# Altium schematic sheet Ring 3_B.SchDoc
size A; SheetNumber: 15; SheetTotal: 30
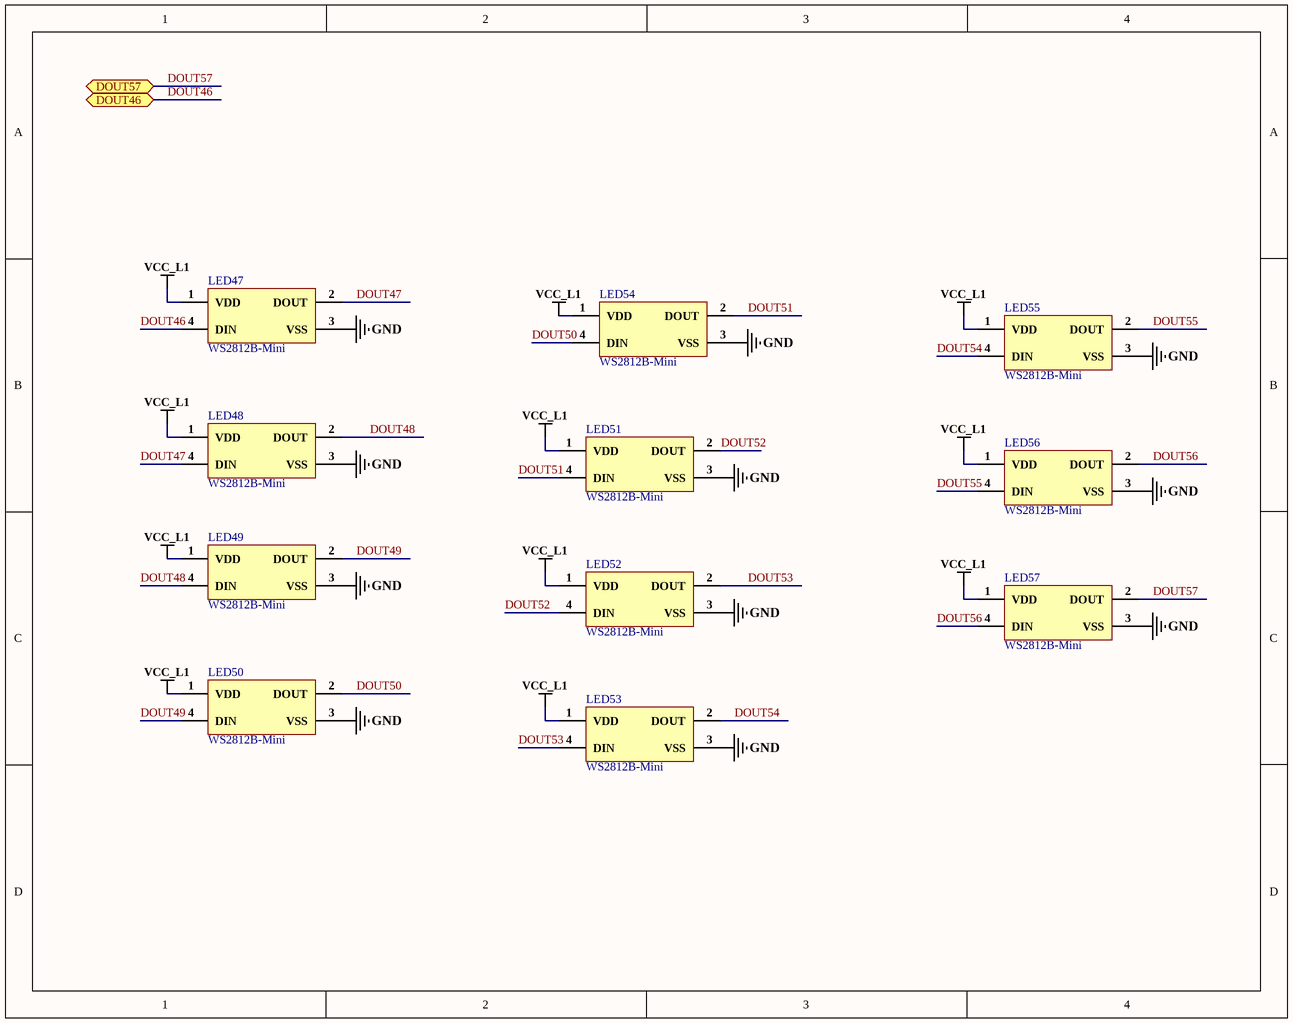
[diagram p0: Ring 3_B.SchDoc]

## Parts
LED47  WS2812B-Mini  [WS2812B-Mini]
LED48  WS2812B-Mini  [WS2812B-Mini]
LED49  WS2812B-Mini  [WS2812B-Mini]
LED50  WS2812B-Mini  [WS2812B-Mini]
LED51  WS2812B-Mini  [WS2812B-Mini]
LED52  WS2812B-Mini  [WS2812B-Mini]
LED53  WS2812B-Mini  [WS2812B-Mini]
LED54  WS2812B-Mini  [WS2812B-Mini]
LED55  WS2812B-Mini  [WS2812B-Mini]
LED56  WS2812B-Mini  [WS2812B-Mini]
LED57  WS2812B-Mini  [WS2812B-Mini]

## Ports
DOUT46 (bidir), DOUT57 (bidir)

## Nets
GND: LED47.3(VSS) LED48.3(VSS) LED49.3(VSS) LED50.3(VSS) LED51.3(VSS) LED52.3(VSS) LED53.3(VSS) LED54.3(VSS) LED55.3(VSS) LED56.3(VSS) LED57.3(VSS)
VCC_L1: LED47.1(VDD) LED48.1(VDD) LED49.1(VDD) LED50.1(VDD) LED51.1(VDD) LED52.1(VDD) LED53.1(VDD) LED54.1(VDD) LED55.1(VDD) LED56.1(VDD) LED57.1(VDD)
DOUT46: LED47.4(DIN) ; port DOUT46
DOUT47: LED47.2(DOUT) LED48.4(DIN)
DOUT48: LED48.2(DOUT) LED49.4(DIN)
DOUT49: LED49.2(DOUT) LED50.4(DIN)
DOUT50: LED50.2(DOUT) LED54.4(DIN)
DOUT51: LED51.4(DIN) LED54.2(DOUT)
DOUT52: LED51.2(DOUT) LED52.4(DIN)
DOUT53: LED52.2(DOUT) LED53.4(DIN)
DOUT54: LED53.2(DOUT) LED55.4(DIN)
DOUT55: LED55.2(DOUT) LED56.4(DIN)
DOUT56: LED56.2(DOUT) LED57.4(DIN)
DOUT57: LED57.2(DOUT) ; port DOUT57

## Library data of the parts
LED47-LED57 = WS2812B-Mini: SMD,3.5x3.5mm Light Emitting Diodes (LED) RoHS; Manufacturer: Worldsemi; ComponentLink1Description: LCSC; ComponentLink1URL: *https://lcsc.com/product-detail/Light-Emitting-Diodes-LED_Worldsemi-WS2812B-Mini_C527089.html; Package: SMD,3.5x3.5mm; Parameter 1: *